# EAGLE design Xbee_Sheild_v2 (EAGLE 6.5.0)
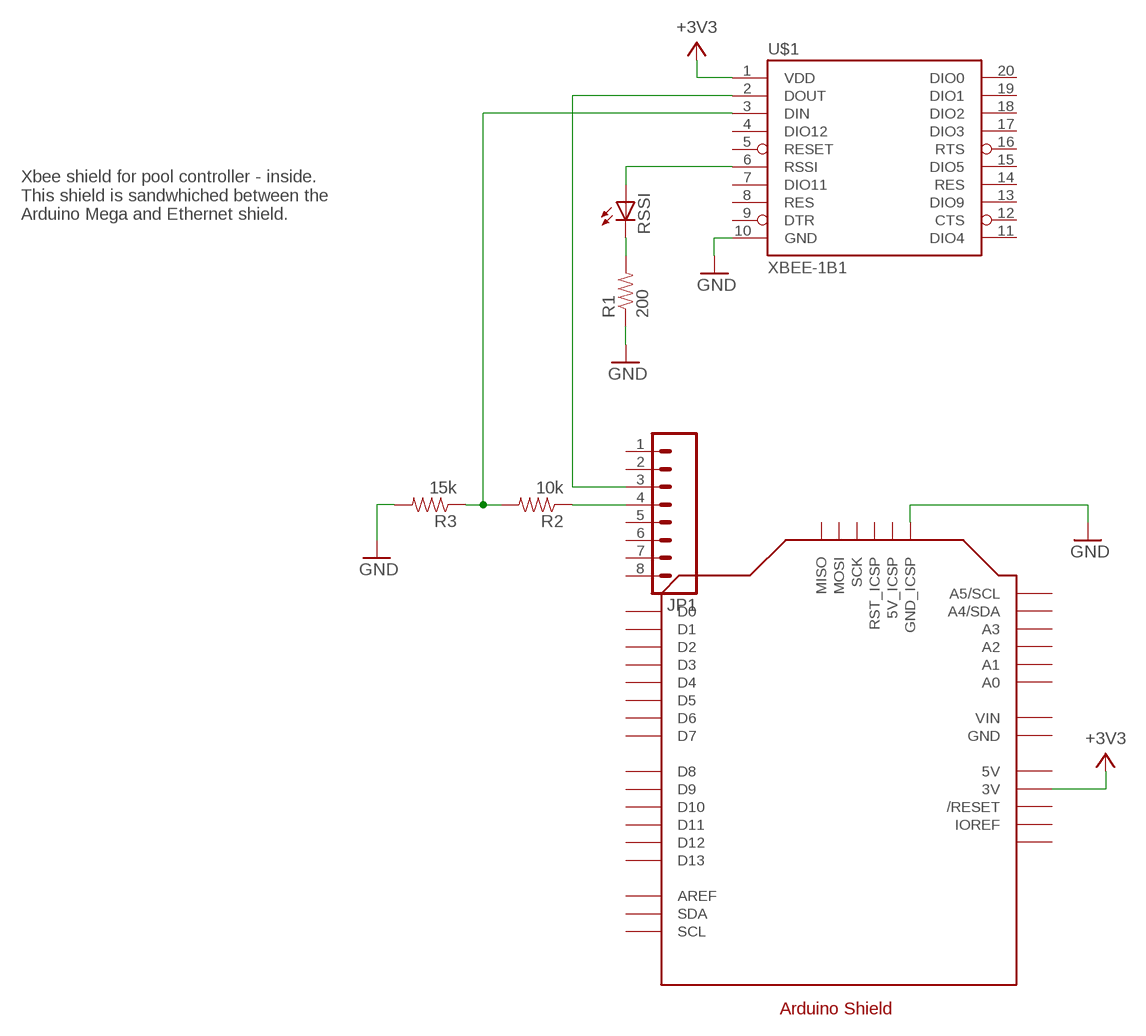
[diagram p0: schematic, sheet 1]

## Parts
JP1  M08LONGPADS  [1X08_LONGPADS]
R1  200  RESISTORPTH-1/4W  [AXIAL-0.4]
R2  10k  RESISTORPTH-1/4W  [AXIAL-0.4]
R3  15k  RESISTORPTH-1/4W  [AXIAL-0.4]
RSSI  LED5MM  [LED5MM]
U$1  XBEE-1B1  [XBEE-1]
U$2  ARDUINO_UNO_SHIELD_ICSP  [ARDUINO_UNO_SHIELD_ICSP]

## Nets
+3V3: U$1.1(VDD) U$2.3V
GND: R1.P$1 R3.P$2 U$1.10(GND) U$2.GND_ICSP
N$1: JP1.3 U$1.2(DOUT)
N$3: JP1.4 R2.P$1
N$4: RSSI.A U$1.6(RSSI)
N$5: R1.P$2 RSSI.K(C)
N$6: R2.P$2 R3.P$1 U$1.3(DIN)
Unconnected: JP1.1 JP1.2 JP1.5 JP1.6 JP1.7 JP1.8 U$1.4(DIO12) U$1.5(RESET) U$1.7(DIO11) U$1.8(RES) U$1.9(DTR) U$1.11(DIO4) U$1.12(CTS) U$1.13(DIO9) U$1.14(RES) U$1.15(DIO5) U$1.16(RTS) U$1.17(DIO3) U$1.18(DIO2) U$1.19(DIO1) U$1.20(DIO0) U$2.A0 U$2.A1 U$2.A2 U$2.A3 U$2.A4(A4/SDA) U$2.A5(A5/SCL) U$2.AREF U$2.D0 U$2.D1 U$2.D2 U$2.D3 U$2.D4 U$2.D5 U$2.D6 U$2.D7 U$2.D8 U$2.D9 U$2.D10 U$2.D11 U$2.D12 U$2.D13 U$2.IOREF U$2.MISO U$2.MOSI U$2.RESERVED U$2.RESET(/RESET) U$2.RST_ICSP U$2.SCK U$2.SCL U$2.SDA

## Notes on the sheet
- Xbee shield for pool controller - inside. 
  This shield is sandwhiched between the
  Arduino Mega and Ethernet shield.

## Power pins joined to a net without a drawn wire
5V: U$2.5V@1(5V)
5V_ICSP: U$2.5V_ICSP
GND: U$2.GND@1(GND) U$2.GND@2(GND) U$2.GND@3(GND)
VIN: U$2.VIN

## Library data of the parts
JP1 = SparkFun-Connectors:M08: Header 8 Standard 8-pin 0.1" header. Use with straight break away headers (SKU : PRT-00116), right angle break away headers (PRT-00553), swiss pins (PRT-00743), machine pins (PRT-00117), and female headers (PRT-00115).
R1-R3 = SparkFun-Resistors:RESISTOR: Resistor Basic schematic elements and footprints for 0603, 1206, and PTH resistors.
RSSI = adafruit:LED: LED OSRAM: - CHIPLED LG R971, LG N971, LY N971, LG Q971, LY Q971, LO R971, LY R971 LH N974, LH R974 LS Q976, LO Q976, LY Q976 LO Q996 - Hyper CHIPLED LW Q18S LB Q993, LB Q99A, LB R99A - SideLED LS A670, LO A670, LY A670, LG A670, LP A670 LB A673, LV A673, LT A673, LW A673 LH A674 LY A675 LS A676, LA A676, LO A676, LY A676, LW A676 LS A679, LY A679, LG A679 - Hyper Micro SIDELED® LS Y876, LA Y876, LO Y876, LY Y876 LT Y87S - SmartLED LW L88C, LW L88S LB L89C, LB L89S, LG L890 LS L89K, LO L89K, LY L89K LS L896, LA L896, LO L896, LY L896 - TOPLED LS T670, LO T670, LY T670, LG T670, LP T670 LSG T670, LSP T670, LSY T670, LOP T670, LYG T670 LG T671, LOG T671, LSG T671 LB T673, LV T673, LT T673, LW T673 LH T674 LS T676, LA T676, LO T676, LY T676, LB T676, LH T676, LSB T676, LW T676 LB T67C, LV T67C, LT T67C, LS T67K, LO T67K, LY T67K, LW E67C LS E67B, LA E67B, LO E67B, LY E67B, LB E67C, LV E67C, LT E67C LW T67C LS T679, LY T679, LG T679 LS T770, LO T770, LY T770, LG T770, LP T770 LB T773, LV T773, LT T773, LW T773 LH T774 LS E675, LA E675, LY E675, LS T675 LS T776, LA T776, LO T776, LY T776, LB T776 LHGB T686 LT T68C, LB T68C - Hyper Mini TOPLED® LB M676 - Mini TOPLED Santana® LG M470 LS M47K, LO M47K, LY M47K Source: http://www.osram.convergy.de/
U$1 = SparkFun-RF:XBEE-1: Xbee module footprints SMT header is CONN-09042.
U$2 = SRG:ARDUINO_UNO_SHIELD_ICSP: Arduino shield for Uno and Leonardo

## Board
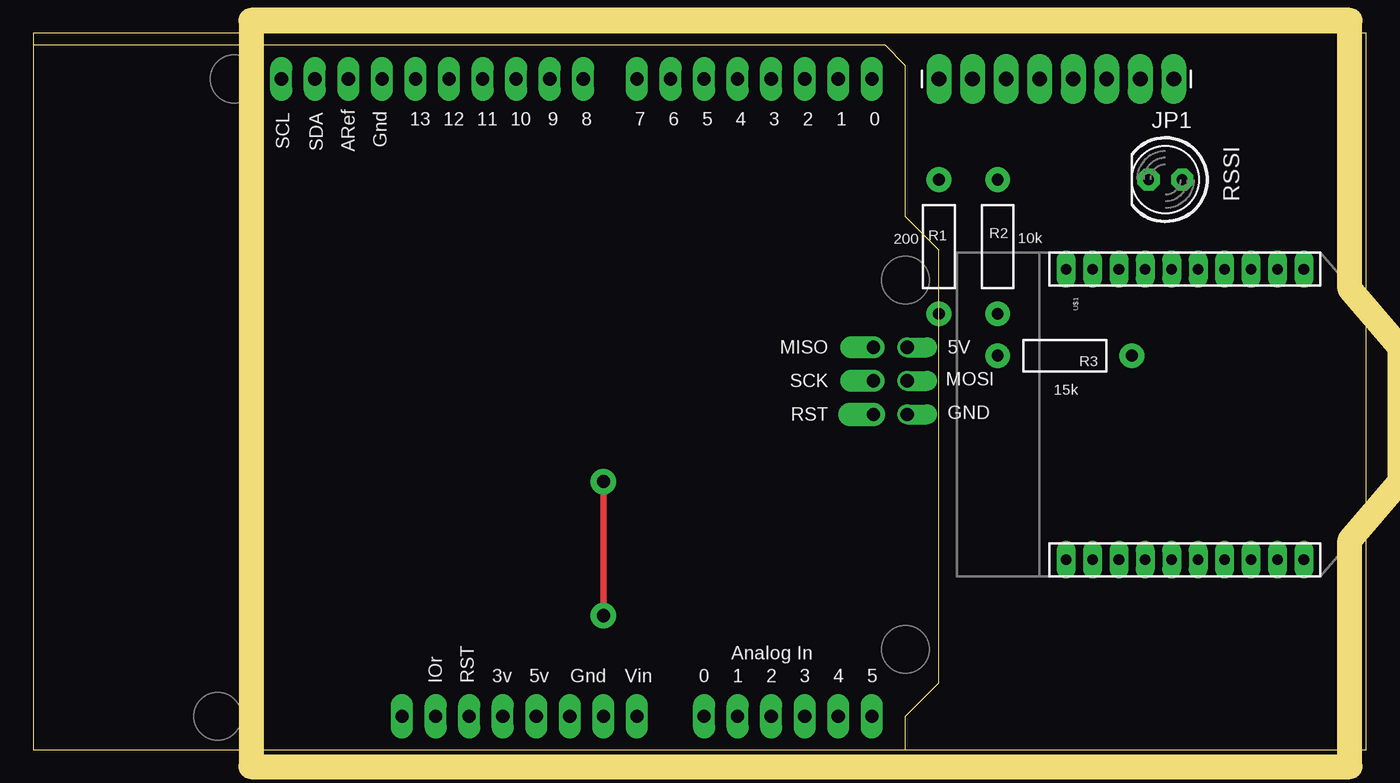
[diagram p1: board, top side]
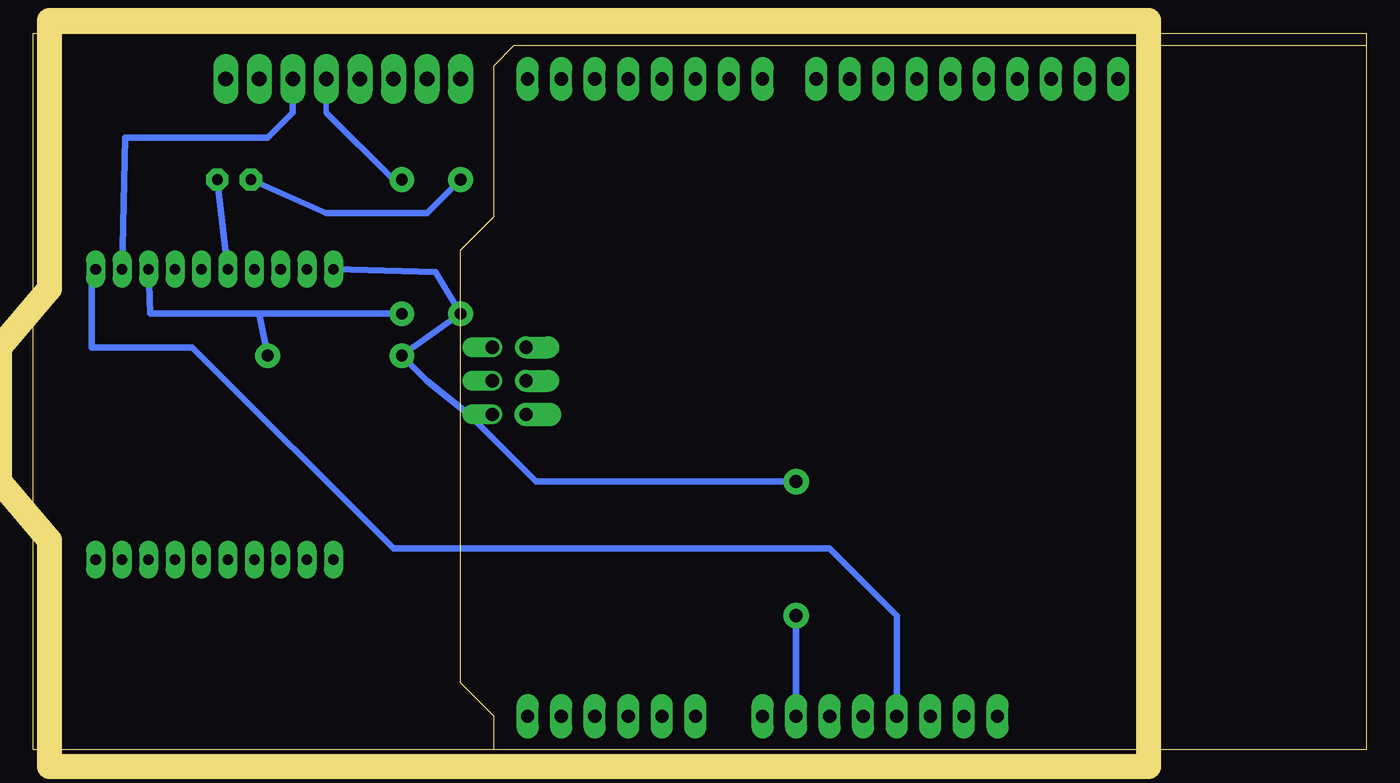
[diagram p2: board, bottom side, seen from below]

Size 100.94 x 54.28 mm. Coordinates in mm from the lower left corner, seen from the top.
Outline: 0,0 100.94,0 100.94,54.28 0,54.28 0,0
Copper layers (1*16): Top 0.035mm / dielectric 1.5mm / Bottom 0.035mm
Design rules "default": minimum track width 10mil, minimum drill 24mil, track to track 8mil, track to pad 8mil, pad to pad 8mil, via to via 8mil, smd to smd 8mil, copper to edge 40mil, drill to drill 8mil, minimum pad ring 10mil, minimum via ring 8mil, stop-mask expansion 4mil, vias tented up to drill 0mil, thermal gap 10mil
Milling: 8 lines

### Footprints (pad centres in the part's own frame; a part is rotated, then mirrored left to right if it is on the bottom)
1X08_LONGPADS = drill 1.118 pad 1.88 long: 1 0,0; 2 2.54,0; 3 5.08,0; 4 7.62,0; 5 10.16,0; 6 12.7,0; 7 15.24,0; 8 17.78,0
AXIAL-0.4 = drill 0.9 pad 1.88: P$1 -5.08,0; P$2 5.08,0
LED5MM = drill 0.813 pad 1.676 octagon: A -1.27,0; K 1.27,0
XBEE-1 = drill 0.8 pad 1.422 long: 1 -11,20; 2 -11,18; 3 -11,16; 4 -11,14; 5 -11,12; 6 -11,10; 7 -11,8; 8 -11,6; 9 -11,4; 10 -11,2; 11 11,2; 12 11,4; 13 11,6; 14 11,8; 15 11,10; 16 11,12; 17 11,14; 18 11,16; 19 11,18; 20 11,20
ARDUINO_UNO_SHIELD_ICSP = drill 1 pad 1.676 long: 3V 1.27,-21.59; 5V@1 3.81,-21.59; A0 16.51,-21.59; A1 19.05,-21.59; A2 21.59,-21.59; A3 24.13,-21.59; A4 26.67,-21.59; A5 29.21,-21.59; AREF -10.414,26.67; D0 29.21,26.67; D1 26.67,26.67; D2 24.13,26.67; D3 21.59,26.67; D4 19.05,26.67; D5 16.51,26.67; D6 13.97,26.67; D7 11.43,26.67; D8 7.366,26.67; D9 4.826,26.67; D10 2.286,26.67; D11 -0.254,26.67; D12 -2.794,26.67; D13 -5.334,26.67; GND@1 8.89,-21.59; GND@2 6.35,-21.59; GND@3 -7.874,26.67; IOREF -3.81,-21.59; RESERVED -6.35,-21.59; RESET -1.27,-21.59; SCL -15.494,26.67; SDA -12.954,26.67; VIN 11.43,-21.59 | drill 1 pad 1.422 offset: 5V_ICSP 31.877,6.35; GND_ICSP 31.877,1.27; MOSI 31.877,3.81 | drill 1 pad 1.676 offset: MISO 29.337,6.35; SCK 29.337,3.81 | drill 1 pad 1.778 offset: RST_ICSP 29.337,1.27

### Placement (x,y rotation side)
JP1  86.36,50.8 180 top
R1  68.58,38.1 90 top
R2  73.03,38.1 270 top
R3  78.11,29.84 180 top
RSSI  85.72,43.18 180 top
U$1  76.2,25.4 270 top
U$2  34.29,24.13 0 top

### Tracks (layer width: path | path; a pad name or v marks a point on that pad's centre or on a via)
+3V3
  Bottom 0.508: U$2.3V 35.56,10.16 40.64,15.24 73.66,15.24 88.9,30.48 96.52,30.48 96.52,36.08 U$1.1
GND  (via drill 1 pad 1.93)
  Top 0.508: v43.18,10.16 v43.18,20.32
  Bottom 0.508: 67.94,25.4 71.12,27.94 R3.P$2 R1.P$1 70.48,36.2 U$1.10 | 67.94,25.4 U$2.GND_ICSP | U$2.GND@1 v43.18,10.16 | v43.18,20.32 62.87,20.32 67.94,25.4
N$1
  Bottom 0.508: JP1.3 81.28,48.26 83.19,46.35 93.98,46.35 U$1.2
N$3
  Bottom 0.406: R2.P$1 73.66,43.18 78.74,48.26 JP1.4
N$4
  Bottom 0.508: RSSI.A U$1.6
N$5
  Bottom 0.508: R1.P$2 71.12,40.64 78.74,40.64 RSSI.K
N$6
  Bottom 0.508: R3.P$1 83.82,33.02 | 83.82,33.02 92.08,33.02 U$1.3 | R2.P$2 83.82,33.02